# Altium schematic sheet isoRS485_block.SchDoc
size 420 x 297 mm; DocumentNumber: ЛАЭ3.20.10.02.05.200 Э3; SheetNumber: 5
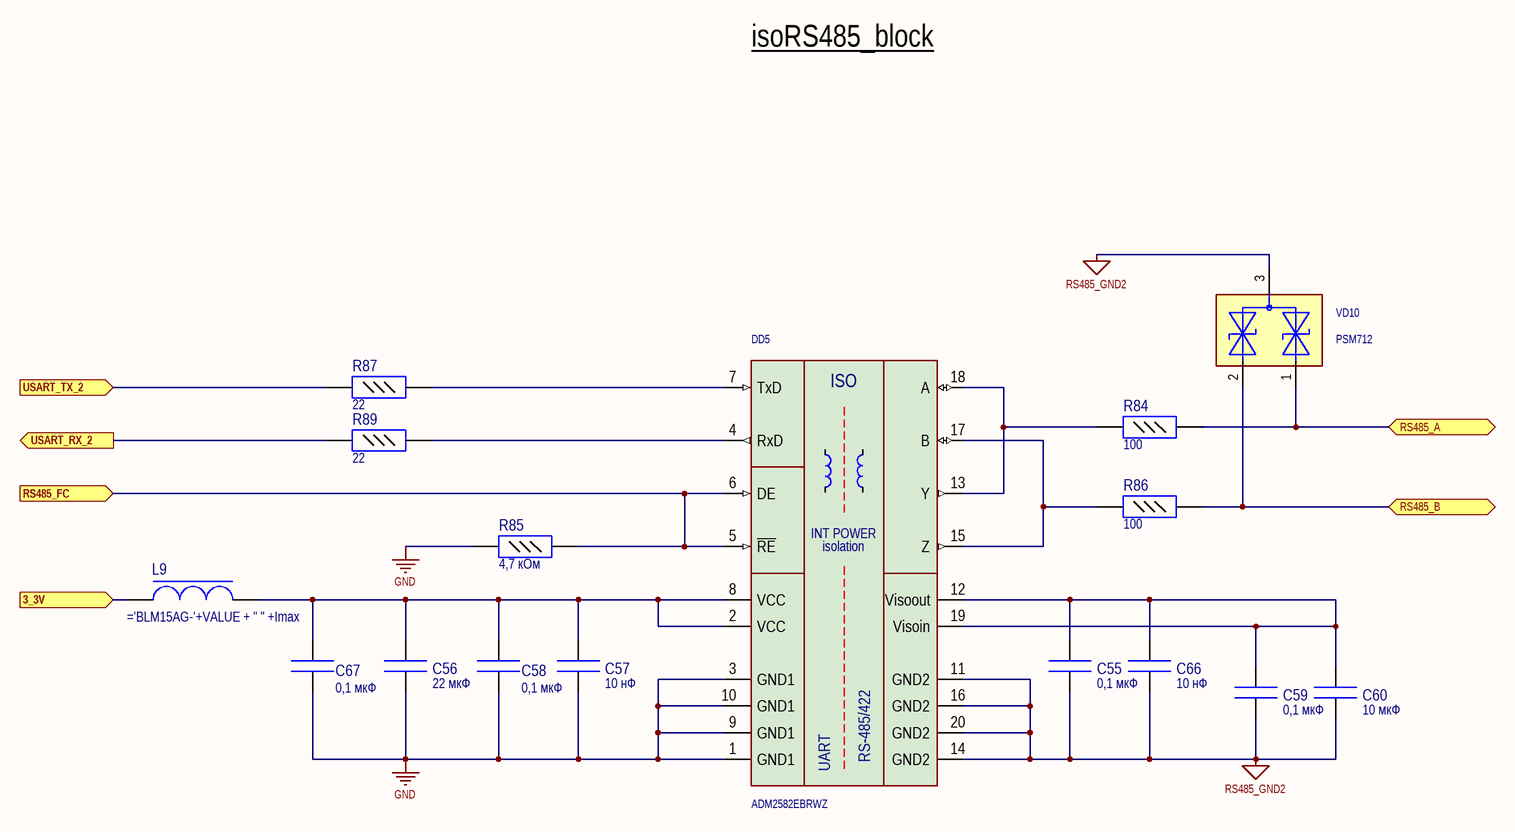
[diagram p0: isoRS485_block.SchDoc]

## Parts
C55  value 0,1 мкФ  [CC0402(1005)]  (hidden comment: CC0402-X7R-0,1 мкФ-20%-50В)
C56  value 22 мкФ  [CC1206]  (hidden comment: CC1206-X7R-22 мкФ-20%-50В)
C57  value 10 нФ  [CC0402(1005)]  (hidden comment: CC0402-X7R-10 нФ-20%-50В)
C58  value 0,1 мкФ  [CC0402(1005)]  (hidden comment: CC0402-X7R-0,1 мкФ-20%-50В)
C59  value 0,1 мкФ  [CC0402(1005)]  (hidden comment: CC0402-X7R-0,1 мкФ-20%-50В)
C60  value 10 мкФ  [CC0603]  (hidden comment: CC0603-X7R-10 мкФ-20%-50В)
C66  value 10 нФ  [CC0402(1005)]  (hidden comment: CC0402-X7R-10 нФ-20%-50В)
C67  value 0,1 мкФ  [CC0402(1005)]  (hidden comment: CC0402-X7R-0,1 мкФ-20%-50В)
DD5  ADM2582EBRWZ  [SOIC-W-20]
L9  (no value)  [CL0402(1005)]
R84  value 100  [CR0603]  (hidden comment: CR0603-100-±5%)
R85  value 4,7 кОм  [CR0603]  (hidden comment: CR0603-4,7 кОм-±5%)
R86  value 100  [CR0603]  (hidden comment: CR0603-100-±5%)
R87  value 22  [CR0603]  (hidden comment: CR0603-22-±5%)
R89  value 22  [CR0603]  (hidden comment: CR0603-22-±5%)
VD10  PSM712  [SOT-23]

## Ports
3_3V (in), RS485_A (bidir), RS485_B (bidir), RS485_FC (in), USART_RX_2 (out), USART_TX_2 (in)

## Nets
GND: C56.2(-) C57.1(+) C58.1(+) C67.1(+) DD5.1(GND1) DD5.3(GND1) DD5.9(GND1) DD5.10(GND1) R85.2(-)
RS485_GND2: C55.2(-) C59.2(-) C60.2(-) C66.2(-) DD5.11(GND2) DD5.14(GND2) DD5.16(GND2) DD5.20(GND2) VD10.3
3_3V: L9.1 ; port 3_3V
RS485_A: R84.2(-) VD10.1 ; port RS485_A
RS485_B: R86.2(-) VD10.2 ; port RS485_B
RS485_FC: DD5.5(~{RE}) DD5.6(DE) R85.1(+) ; port RS485_FC
USART_RX_2: R89.1(+) ; port USART_RX_2
USART_TX_2: R87.1(+) ; port USART_TX_2
NetC55_1: C55.1(+) C59.1(+) C60.1(+) C66.1(+) DD5.12(Visoout) DD5.19(Visoin)
NetC56_1: C56.1(+) C57.2(-) C58.2(-) C67.2(-) DD5.2(VCC) DD5.8(VCC) L9.2
NetDD5_4: DD5.4(RxD) R89.2(-)
NetDD5_7: DD5.7(TxD) R87.2(-)
NetDD5_13: DD5.13(Y) DD5.18(A) R84.1(+)
NetDD5_15: DD5.15(Z) DD5.17(B) R86.1(+)

## Notes on the sheet
- isoRS485_block
- Подп. и дата
- Инв. № дубл.
- Взам. инв. №
- Инв. № подл.
- Изм.
- Лист
- № докум.
- Подп.
- Дата
- 2.106-A3
- Копировал
- Формат А3
- (in symbol ADM2582E) ISO; INT POWER; isolation; RS-485/422; UART

## Library data of the parts
C55 C57-C59 C66 C67 = CC0402-X7R-#-20%-50В: Чип конденсатор керамический; Supplier 1: Digi-Key; Supplier Part Number 1: 399-3066-1-ND
C56 = CC1206-X7R-#-20%-50В: Чип конденсатор керамический
C60 = CC0603-X7R-#-20%-50В: Чип конденсатор керамический; Компэл: CC0603KRX7R9BB104; Supplier 1: Newark; Supplier Part Number 1: 65R8251
DD5 = ADM2582E: Isolated RS-485/RS-422 transceiver, configurable as half or full duplex isoPower® integrated isolated dc-to-dc converter; Manufacturer: Anallog Devices; Data Rate: 16 Mbps; Voltage: 3.3 V or 5 V; PartNumber: ADM2582EBRWZ; Temperature: -40...+85 °C; Supplier 1: Mouser; Supplier Part Number 1: 584-ADM2582EBRWZ
L9 = BLM15: Чип индуктивность подавления EMP; VALUE: 600 Ом; Компэл: BLM15AG601SN1D; Imax: 300 mA; Supplier 1: Farnell; Supplier Part Number 1: 1515762
R84-R87 R89 = CR0603-#-±5%: Чип резистор
VD10 = PSM712: ESD RS-485; Supplier 1: Octopart; Supplier Part Number 1: GreenTree Electronics - PSM712-LF-T7